# EAGLE design midispoof (EAGLE 9.6.1)
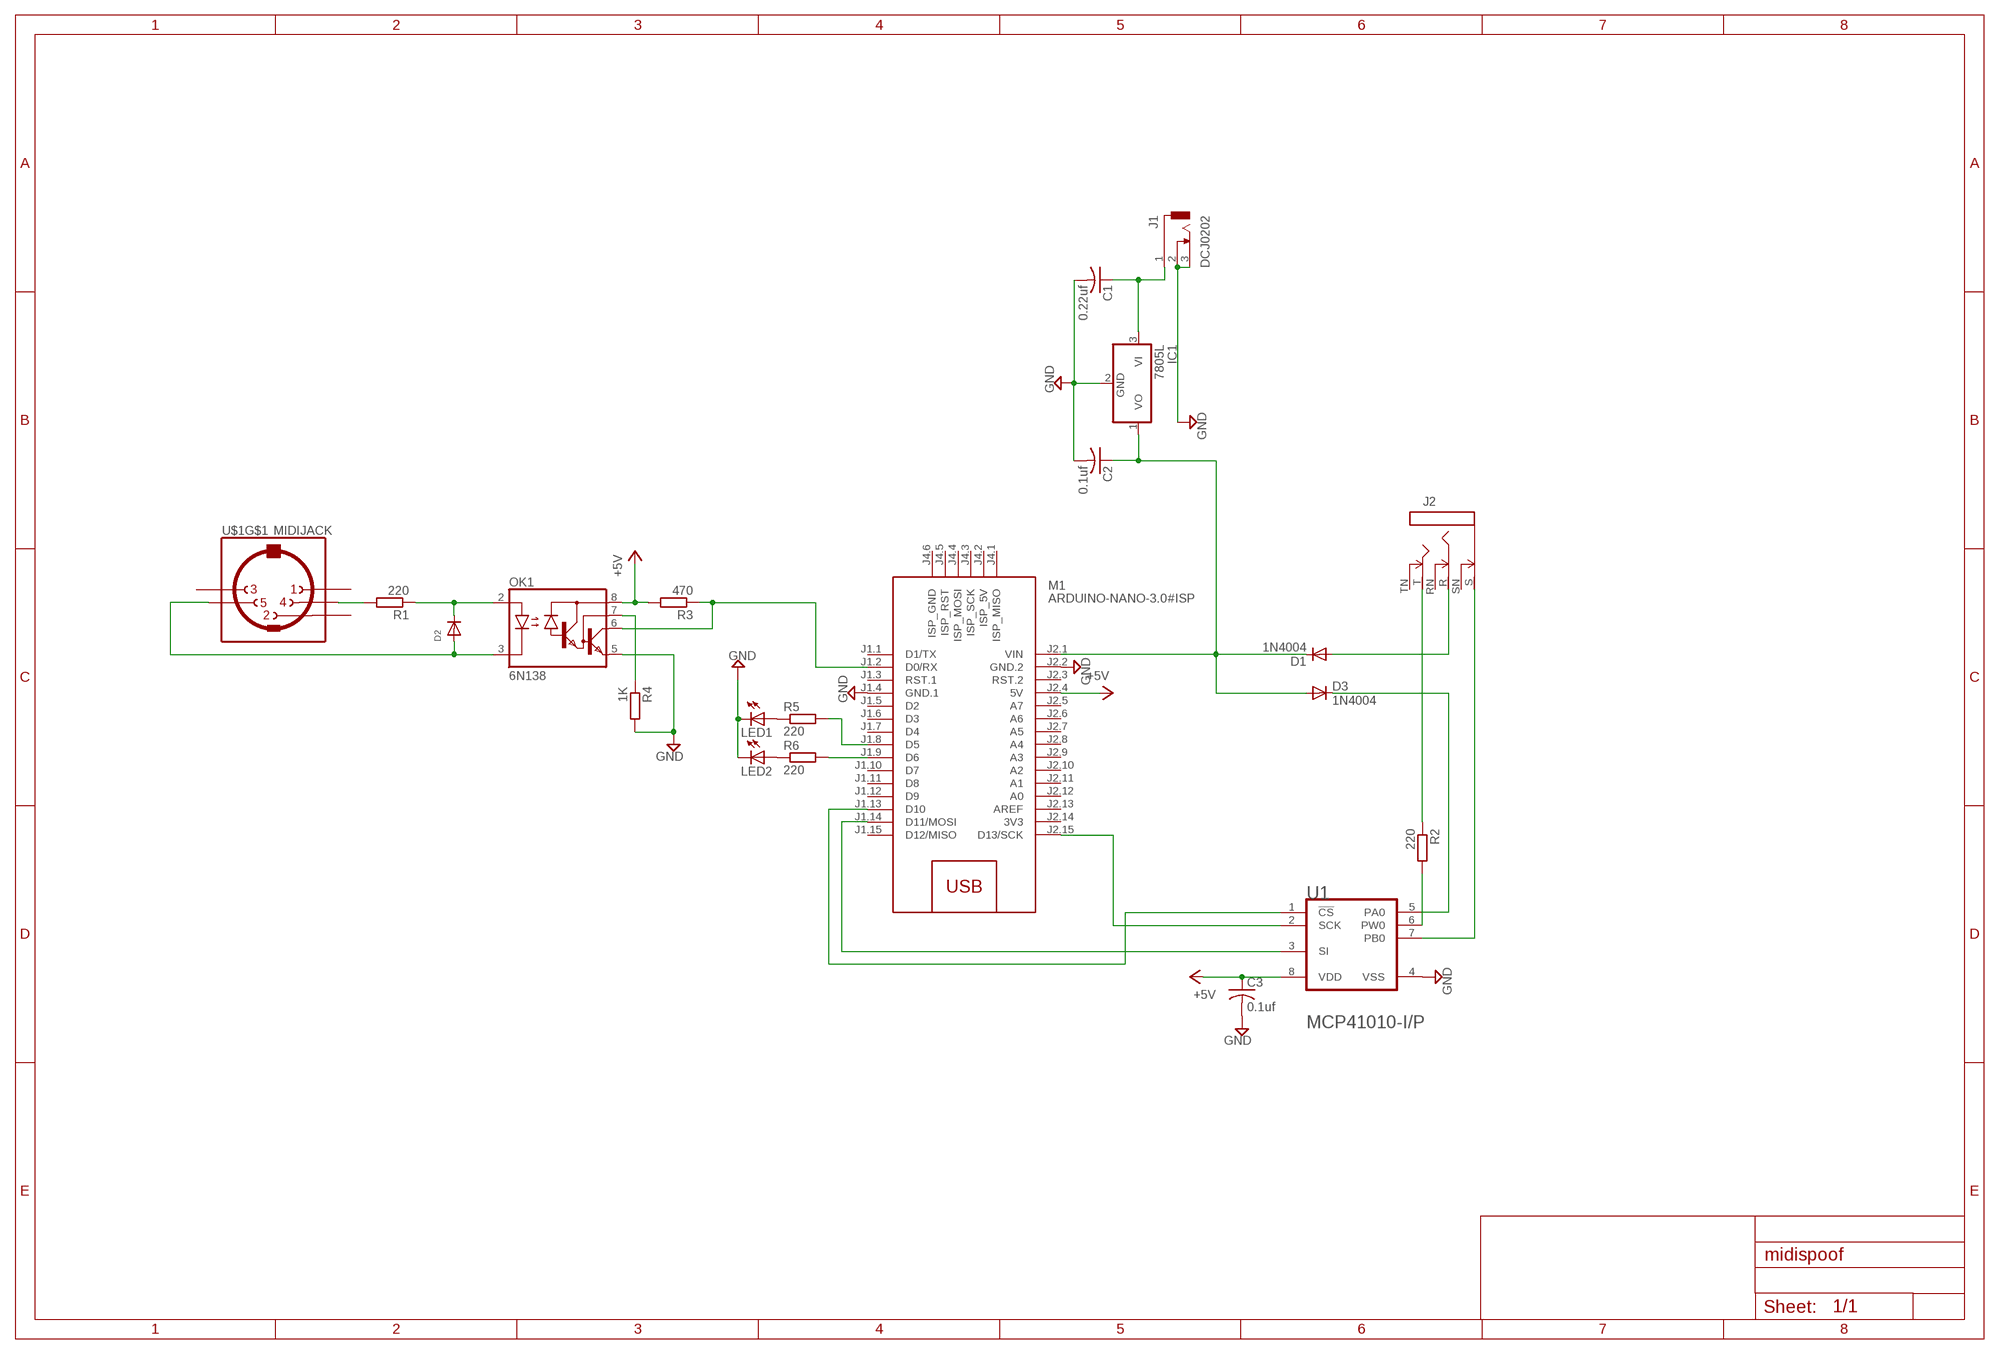
[diagram p0: schematic, sheet 1]

## Parts
C1  0.22uf  C-US050-025X075  [C050-025X075]
C2  0.1uf  C-US050-025X075  [C050-025X075]
C3  0.1uf  C-US050-025X075  [C050-025X075]
D1  1N4004  [DO41-10]
D2  DIODEDO-1N4148  [DO-1N4148]
D3  1N4004  [DO41-10]
IC1  7805L  [TO92]
J1  DCJ0202  [DCJ0202]
J2  STEREOSWS  [NMJ6HC-S]
LED1  LED3MM  [LED3MM]
LED2  LED3MM  [LED3MM]
M1  ARDUINO-NANO-3.0#ISP  [ARDUINO-NANO-3.0#ISP]
OK1  6N138  [DIL08]
R1  220  R-EU_0207/10  [0207/10]
R2  220  R-EU_0207/10  [0207/10]
R3  470  R-EU_0207/10  [0207/10]
R4  1K  R-EU_0207/10  [0207/10]
R5  220  R-EU_0207/10  [0207/10]
R6  220  R-EU_0207/10  [0207/10]
U1  MICROCHIP_MCP41010-I-PMICROCHIP_MCP41010-I-P_0_0  [MICROCHIP_MCP41010-I-P_0]
U$1  MIDIJACK  [CP-2350]

## Nets
+5V: C3.1 M1.J2.4(5V) OK1.8(VCC) R3.2 U1.8(VDD)
GND: C1.2 C2.2 C3.2 IC1.2(GND) J1.2 J1.3 LED1.K(C) LED2.K(C) M1.J1.4(GND.1) M1.J2.2(GND.2) OK1.5(GND) R4.2 U1.4(VSS)
N$1: M1.J2.15(D13/SCK) U1.2(SCK)
N$2: C1.1 IC1.3(VI) J1.1
N$3: M1.J1.14(D11/MOSI) U1.3(SI)
N$4: LED1.A R5.1
N$5: R1.2 U$1.4
N$6: M1.J1.13(D10) U1.1(!CS!)
N$7: D1.A J2.R
N$8: D3.C U1.5(PA0)
N$9: J2.S U1.7(PB0)
N$10: J2.T R2.1
N$11: R2.2 U1.6(PW0)
N$12: D2.C OK1.2(A) R1.1
N$13: D2.A OK1.3(C) U$1.5
N$14: M1.J1.2(D0/RX) OK1.6(VO) R3.1
N$15: C2.1 D1.C D3.A IC1.1(VO) M1.J2.1(VIN)
N$16: OK1.7(VB) R4.1
N$17: LED2.A R6.1
N$18: M1.J1.8(D5) R5.2
N$19: M1.J1.9(D6) R6.2
Unconnected: J2.RN J2.SN J2.TN M1.J1.1(D1/TX) M1.J1.3(RST.1) M1.J1.5(D2) M1.J1.6(D3) M1.J1.7(D4) M1.J1.10(D7) M1.J1.11(D8) M1.J1.12(D9) M1.J1.15(D12/MISO) M1.J2.3(RST.2) M1.J2.5(A7) M1.J2.6(A6) M1.J2.7(A5) M1.J2.8(A4) M1.J2.9(A3) M1.J2.10(A2) M1.J2.11(A1) M1.J2.12(A0) M1.J2.13(AREF) M1.J4.1(ISP_MISO) M1.J4.2(ISP_5V) M1.J4.3(ISP_SCK) M1.J4.4(ISP_MOSI) M1.J4.5(ISP_RST) M1.J4.6(ISP_GND) U$1.1 U$1.2 U$1.3 U$1.PE1(MT) U$1.PE2(MT) U$1.PE(MT) U$1.PE@(MT)

## Power pins joined to a net without a drawn wire
3V3: M1.J2.14(3V3)

## Library data of the parts
C1-C3 = adafruit:C-US: CAPACITOR, American symbol
D1 D3 = adafruit:1N4004: DIODE General purpose 1N400x type rectifier (With bigger pads) http://www.ladyada.net/library/pcb/eaglelibrary.html
D2 = adafruit:DIODE: Diode SMADIODE - SMA Surface Mount Package 20V 1A Schottky Diode Digikey: 641-1014-6-ND DO-1N4148 - Through Hole Small Current Diode SOD-123 20V 1 A (.5mV Vf) Schottky Diode - Digikey: MBRX120TPMSCT-ND SOD-323 10V 570mA (.38mV Vf, 3ns) Schottky Diode - Digikey: ZLLS410CT-ND SOD-523 30V 30mA Schottky Diode (RB751S-40TE61) - Digikey: RB751S-40TE61CT-ND SOT23-R/W - SOT23 Package (R = Solder Paste/Reflow Ovens, W = Hand-Soldering) BAT54Film 40V 300mA - Digikey: 497-7162-1-ND
IC1 = adafruit:78*: Positive VOLTAGE REGULATOR Added bigger pads to the TO-92 package
J1 = con-jack:DCJ0202: DC POWER JACK Source: DCJ0202.pdf; OC_FARNELL: unknown; OC_NEWARK: unknown
J2 = gm-jacks:STEREOSW
LED1 LED2 = adafruit:LED: LED OSRAM: - CHIPLED LG R971, LG N971, LY N971, LG Q971, LY Q971, LO R971, LY R971 LH N974, LH R974 LS Q976, LO Q976, LY Q976 LO Q996 - Hyper CHIPLED LW Q18S LB Q993, LB Q99A, LB R99A - SideLED LS A670, LO A670, LY A670, LG A670, LP A670 LB A673, LV A673, LT A673, LW A673 LH A674 LY A675 LS A676, LA A676, LO A676, LY A676, LW A676 LS A679, LY A679, LG A679 - Hyper Micro SIDELED® LS Y876, LA Y876, LO Y876, LY Y876 LT Y87S - SmartLED LW L88C, LW L88S LB L89C, LB L89S, LG L890 LS L89K, LO L89K, LY L89K LS L896, LA L896, LO L896, LY L896 - TOPLED LS T670, LO T670, LY T670, LG T670, LP T670 LSG T670, LSP T670, LSY T670, LOP T670, LYG T670 LG T671, LOG T671, LSG T671 LB T673, LV T673, LT T673, LW T673 LH T674 LS T676, LA T676, LO T676, LY T676, LB T676, LH T676, LSB T676, LW T676 LB T67C, LV T67C, LT T67C, LS T67K, LO T67K, LY T67K, LW E67C LS E67B, LA E67B, LO E67B, LY E67B, LB E67C, LV E67C, LT E67C LW T67C LS T679, LY T679, LG T679 LS T770, LO T770, LY T770, LG T770, LP T770 LB T773, LV T773, LT T773, LW T773 LH T774 LS E675, LA E675, LY E675, LS T675 LS T776, LA T776, LO T776, LY T776, LB T776 LHGB T686 LT T68C, LB T68C - Hyper Mini TOPLED® LB M676 - Mini TOPLED Santana® LG M470 LS M47K, LO M47K, LY M47K Source: http://www.osram.convergy.de/
M1 = diy-modules:ARDUINO-NANO-3.0#ISP: Arduino Nano 3.0 (and compatible devices) with ISP pads More details available here: https://www.arduino.cc/en/Main/ArduinoBoardNano Click here to find device on ebay.com <http://www.ebay.com/sch/arduino+nano>
OK1 = optocoupler:6N138: MOTOROLA OPTO COUPLER; MF: VISHAY/TELEFUNKEN; MPN: 6N138; OC_FARNELL: 9860150; OC_NEWARK: 35K5294
R1-R6 = rcl:R-EU_: RESISTOR, European symbol; SPICEPREFIX: R
U1 = P:MICROCHIP_MCP41010-I-P: IN-DPOT-MCP41XXX-8; CIIVA_IDS: 965824; CODE__JEDEC: MS-001; COMPONENT_LINK_1_DESCRIPTION: Manufacturer URL; COMPONENT_LINK_1_URL: http://www.microchip.com/; COMPONENT_LINK_3_DESCRIPTION: Package Specification; COMPONENT_LINK_3_URL: http://www.microchip.com/stellent/groups/techpub_sg/documents/packagingspec/en012702.pdf; DATASHEET: http://ww1.microchip.com/downloads/en/DeviceDoc/11195c.pdf; DATASHEET_VERSION: Jul-2003; FOOTPRINT_VARIANT_NAME_0: Manufacturer Recommended; IMPORTED: yes; IMPORTED_FROM: vault; IMPORT_TS: 1521850027; MF: Microchip; MPN: MCP41010-I/P; PACKAGE: PDIP300-P8; PACKAGE_DESCRIPTION: 8-Lead Plastic Dual In-Line (P) - 300 mil Body [PDIP]; PACKAGE_VERSION: revBB, Aug-2009; PIN_0_0_3_INSIDE_EDGE: clock; PREFIX: U; RELEASE_DATE: 1331947898; VAULT_GUID: 0D1531F0-FDC7-4F73-93B9-BB8B3C9C29AE; VAULT_REVISION: 8471A624-00F0-47E3-A846-A853EE22FFF3
U$1 = adafruit:MIDIJACK: DIN 5 jack also known as MIDI jack A modification of conn-hirshman:MAB5SH with two options for the grounding 'teeth'

## Board
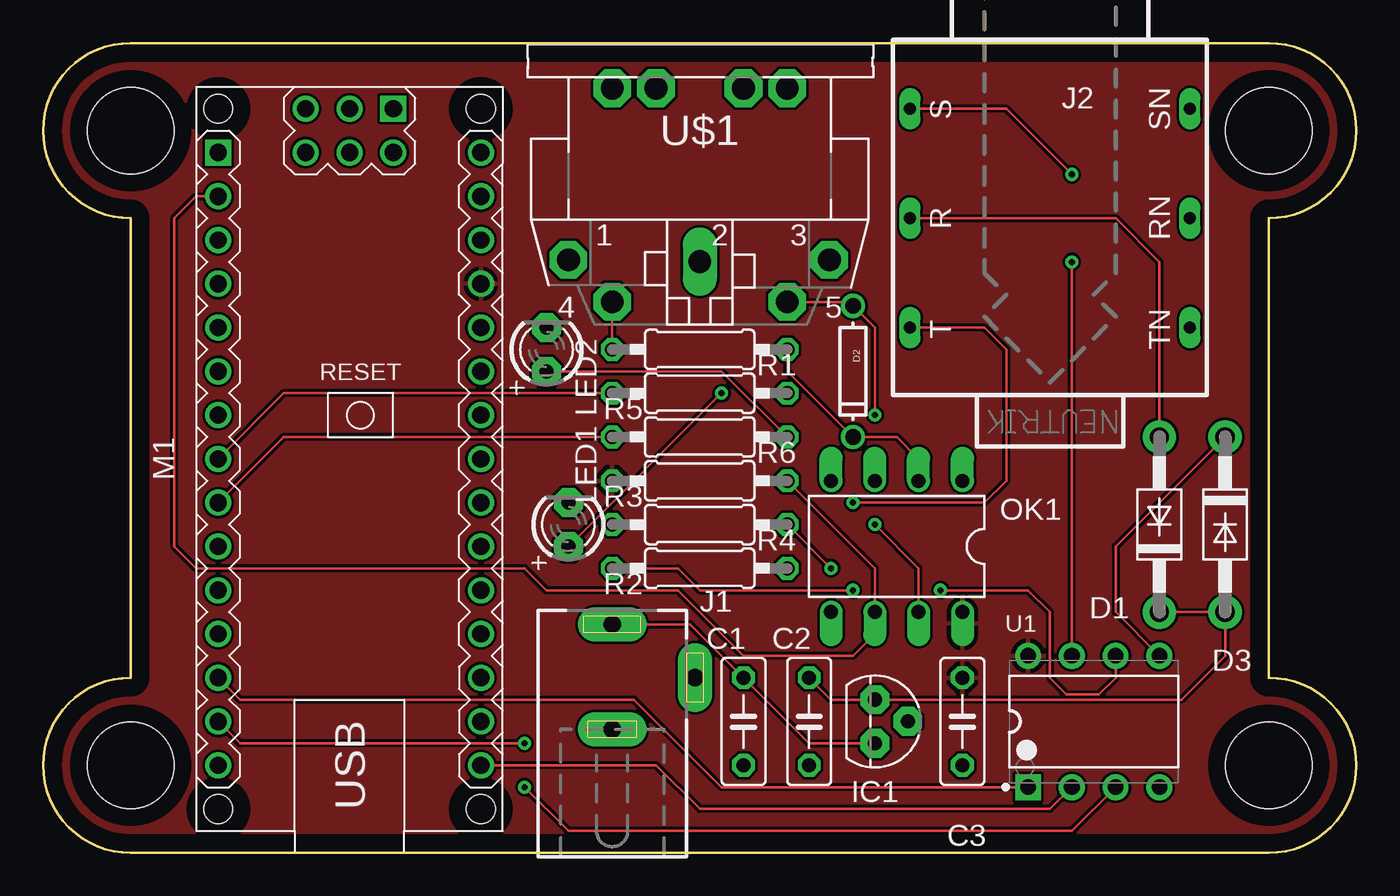
[diagram p1: board, top side]
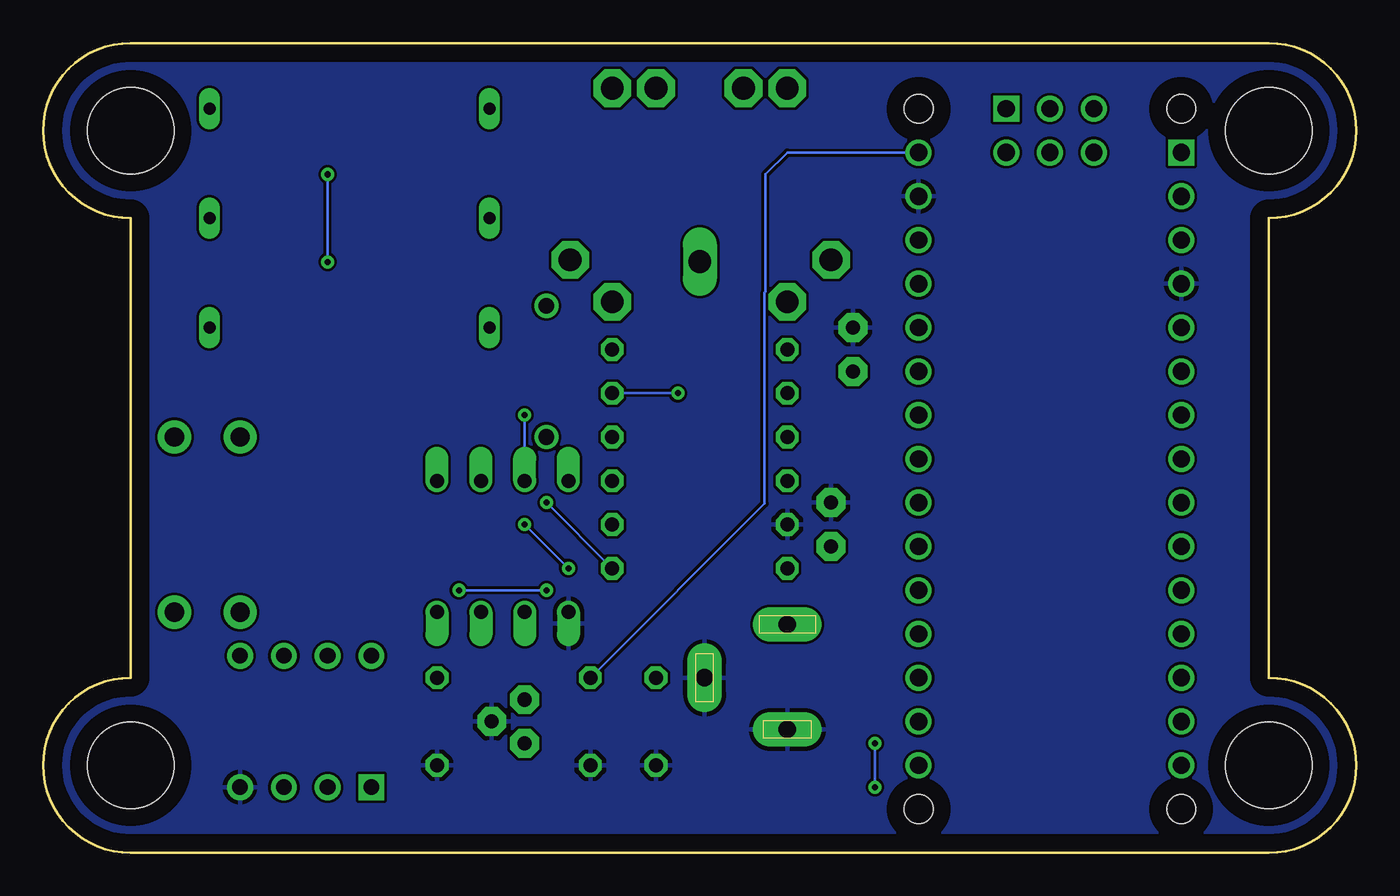
[diagram p2: board, bottom side, seen from below]

Size 76.2 x 46.99 mm. Coordinates in mm from the lower left corner, seen from the top.
Outline: 5.08,46.99 arc180 5.08,36.83 5.08,10.16 arc180 5.08,0 71.12,0 arc180 71.12,10.16 71.12,36.83 arc180 71.12,46.99 5.08,46.99
Copper layers (1*16): Top 0.035mm / dielectric 1.5mm / Bottom 0.035mm
Design rules "default": minimum track width 6mil, minimum drill 0.35mm, track to track 6mil, track to pad 6mil, pad to pad 6mil, via to via 6mil, smd to smd 6mil, copper to edge 40mil, drill to drill 6mil, minimum pad ring 10mil, minimum via ring 8mil, stop-mask expansion 4mil, vias tented up to drill 0mil, thermal gap 10mil
Holes 5 mm at 5.08,5.08 71.12,5.08 71.12,41.91 5.08,41.91

### Footprints (pad centres in the part's own frame; a part is rotated, then mirrored left to right if it is on the bottom)
C050-025X075 = drill 0.813 octagon: 1 -2.54,0; 2 2.54,0
DO41-10 = drill 1.118 pad 1.93: A 5.08,0; C -5.08,0
DO-1N4148 = drill 0.9: A -3.81,0; C 3.81,0
TO92 = drill 0.813 pad 1.676 octagon: 1 -1.27,0; 2 0,1.905; 3 1.27,0
DCJ0202 = drill 1 pad 2 long: 1 0,3.1; 2 4.8,0; 3 0,-3
NMJ6HC-S = drill 0.7 long: R 0,8.115; RN 0,-8.115; S 6.35,8.115; SN 6.35,-8.115; T -6.35,8.115; TN -6.35,-8.115
LED3MM = drill 0.813 pad 1.676 octagon: A -1.27,0; K 1.27,0
ARDUINO-NANO-3.0#ISP = drill 1 square: J1.1 17.78,7.62; J4.1 20.32,-2.54 | drill 1: J1.2 15.24,7.62; J1.3 12.7,7.62; J1.4 10.16,7.62; J1.5 7.62,7.62; J1.6 5.08,7.62; J1.7 2.54,7.62; J1.8 0,7.62; J1.9 -2.54,7.62; J1.10 -5.08,7.62; J1.11 -7.62,7.62; J1.12 -10.16,7.62; J1.13 -12.7,7.62; J1.14 -15.24,7.62; J1.15 -17.78,7.62; J2.1 17.78,-7.62; J2.2 15.24,-7.62; J2.3 12.7,-7.62; J2.4 10.16,-7.62; J2.5 7.62,-7.62; J2.6 5.08,-7.62; J2.7 2.54,-7.62; J2.8 0,-7.62; J2.9 -2.54,-7.62; J2.10 -5.08,-7.62; J2.11 -7.62,-7.62; J2.12 -10.16,-7.62; J2.13 -12.7,-7.62; J2.14 -15.24,-7.62; J2.15 -17.78,-7.62; J4.2 17.78,-2.54; J4.3 20.32,0; J4.4 17.78,0; J4.5 20.32,2.54; J4.6 17.78,2.54 | hole 1.651: -20.32,7.62; -20.32,-7.62; 20.32,-7.62; 20.32,7.62
DIL08 = drill 0.813 offset: 1 -3.81,-3.81; 2 -1.27,-3.81; 3 1.27,-3.81; 4 3.81,-3.81; 5 3.81,3.81; 6 1.27,3.81; 7 -1.27,3.81; 8 -3.81,3.81
0207/10 = drill 0.813 octagon: 1 -5.08,0; 2 5.08,0
MICROCHIP_MCP41010-I-P_0 = drill 0.9 pad 1.5 square: 1 -3.81,3.81 | drill 0.9 pad 1.5: 2 -3.81,1.27; 3 -3.81,-1.27; 4 -3.81,-3.81; 5 3.81,-3.81; 6 3.81,-1.27; 7 3.81,1.27; 8 3.81,3.81
CP-2350 = drill 1.321 pad 2.184 octagon: 1 7.62,12.58; 3 -7.52,12.58; 4 5.08,15.02; 5 -5.08,15.02; PE -2.54,2.62; PE1 -5.08,2.62; PE2 5.08,2.62; PE@ 2.54,2.62 | drill 1.321 long: 2 0,12.68

### Placement (x,y rotation side)
C1  40.64,7.62 270 top
C2  44.45,7.62 270 top
C3  53.34,7.62 270 top
D1  64.77,19.05 90 top
D2  46.99,27.94 270 top
D3  68.58,19.05 270 top
IC1  48.26,7.62 270 top
J1  33.02,10.16 0 top
J2  58.42,36.83 90 top
LED1  30.48,19.05 90 top
LED2  29.21,29.21 90 top
M1  17.78,22.86 90 top
OK1  49.53,17.78 180 top
R1  38.1,29.21 180 top
R2  38.1,16.51 180 top
R3  38.1,21.59 180 top
R4  38.1,19.05 180 top
R5  38.1,26.67 180 top
R6  38.1,24.13 180 top
U1  60.96,7.62 90 top
U$1  38.1,46.99 180 top

### Tracks (layer width: path | path; a pad name or v marks a point on that pad's centre or on a via)
+5V
  pour Top: 0,46.99 76.2,46.99 76.2,0 0,0
GND
  pour Bottom: 0,46.99 76.2,46.99 76.2,0 0,0
N$1
  Top 0.152: U1.2 58.42,2.54 38.1,2.54 35.56,5.08 M1.J2.15
N$2
  Top 0.152: J1.1 37.54,13.26 C1.1 44.45,6.35 IC1.3
N$3  (via drill 0.35)
  Top 0.152: U1.3 59.69,1.27 30.48,1.27 v27.94,3.81 | v27.94,6.35 11.43,6.35 M1.J1.14
  Bottom 0.152: v27.94,3.81 v27.94,6.35
N$4  (via drill 0.35)
  Top 0.152: LED1.A v39.37,26.67
  Bottom 0.152: v39.37,26.67 R5.1
N$5
  Top 0.152: U$1.4 R1.2
N$6
  Top 0.152: U1.1 39.37,3.81 34.29,8.89 11.43,8.89 M1.J1.13
N$7
  Top 0.152: J2.R 62.23,36.83 64.77,34.29 D1.A
N$8
  Top 0.152: D3.C 62.23,17.78 62.23,13.97 U1.5
N$9  (via drill 0.35)
  Top 0.152: U1.7 v59.69,34.29 | v59.69,39.37 55.88,43.18 J2.S
  Bottom 0.152: v59.69,34.29 v59.69,39.37
N$10  (via drill 0.35)
  Top 0.152: v46.99,20.32 54.61,20.32 55.88,21.59 55.88,29.21 54.61,30.48 J2.T
  Bottom 0.152: R2.1 v46.99,20.32
N$11  (via drill 0.35)
  Top 0.152: R2.2 36.83,16.51 38.1,15.24 v46.99,15.24 | v52.07,15.24 57.15,15.24 58.42,13.97 58.42,10.16 59.38,9.2 61.26,9.2 62.23,10.16 U1.6
  Bottom 0.152: v46.99,15.24 v52.07,15.24
N$12
  Top 0.152: OK1.2 50.8,22.86 49.53,24.13 D2.C 43.18,27.94 R1.1
N$13  (via drill 0.35)
  Top 0.152: U$1.5 46.77,31.97 D2.A 48.26,30.48 v48.26,25.4
  Bottom 0.152: OK1.3 v48.26,25.4
N$14
  Top 0.152: M1.J1.2 8.89,38.1 7.62,36.83 7.62,17.78 8.89,16.51 27.94,16.51 29.21,15.24 36.83,15.24 40.64,11.43 46.99,11.43 48.26,12.7 OK1.6 48.26,16.51 R3.1
N$15
  Top 0.152: D1.C D3.A 68.58,11.43 66.04,8.89 IC1.1 45.72,8.89 C2.1
  Bottom 0.152: C2.1 34.34,20.27 34.34,32.52 34.29,32.57 34.29,39.37 33.02,40.64 M1.J2.1
N$16  (via drill 0.35)
  Top 0.152: v45.72,16.51 R4.1 | OK1.7 50.8,16.51 v48.26,19.05
  Bottom 0.152: v48.26,19.05 v45.72,16.51
N$17
  Top 0.152: R6.1 39.37,27.94 LED2.A
N$18
  Top 0.152: R5.2 13.97,26.67 M1.J1.8
N$19
  Top 0.152: M1.J1.9 13.97,24.13 R6.2